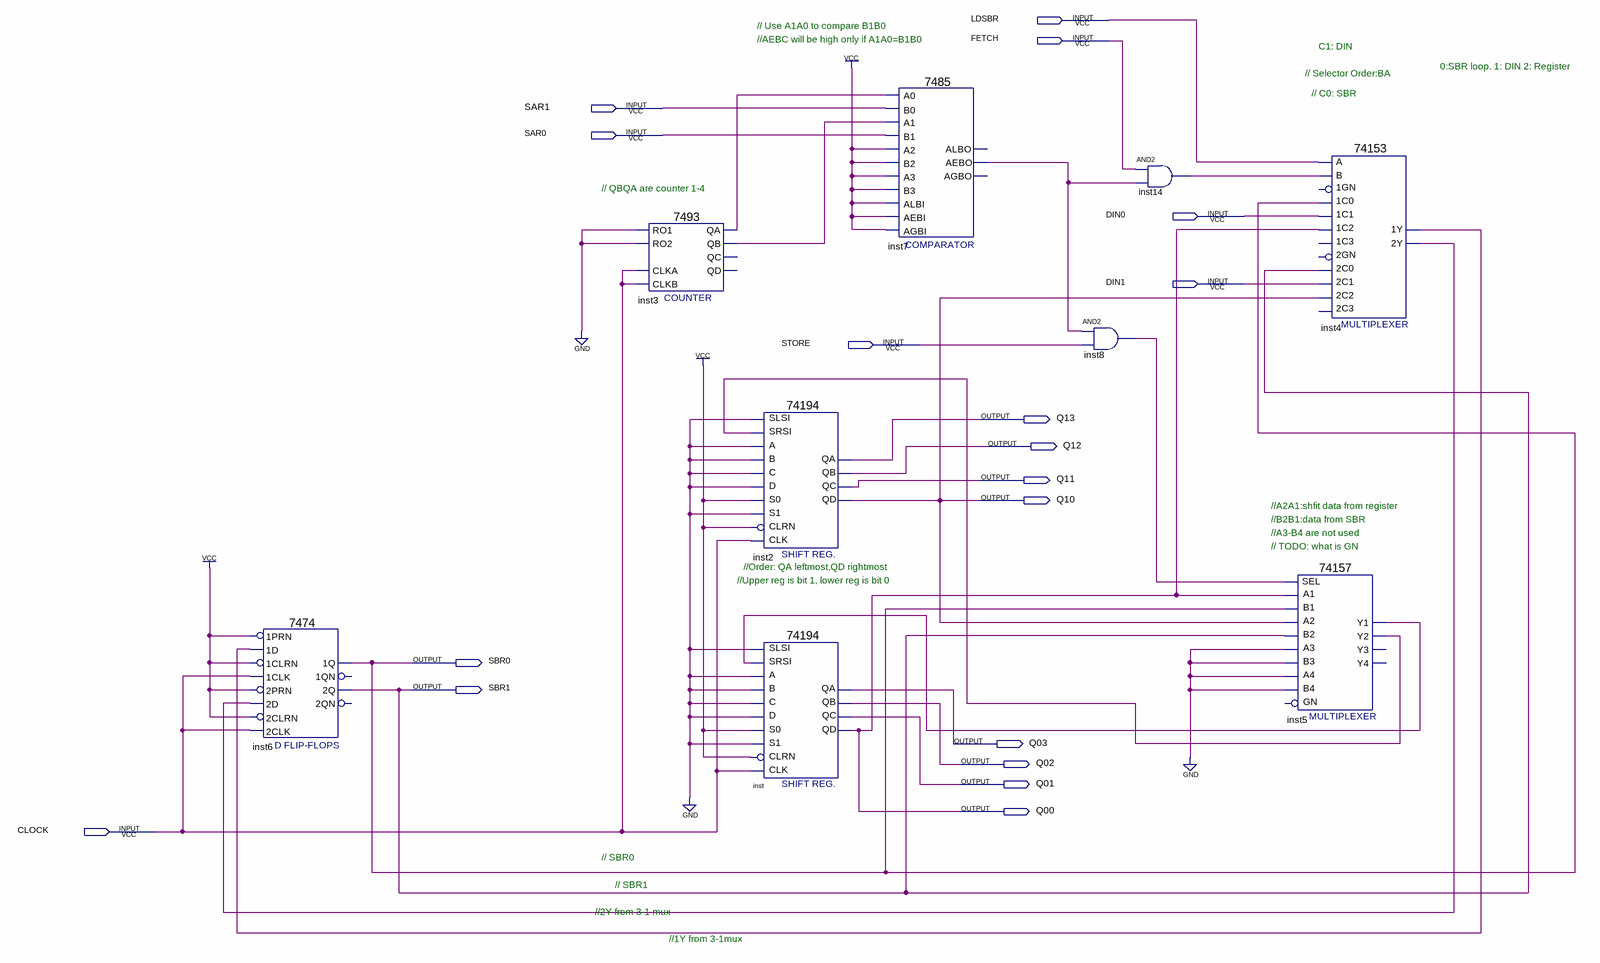
[diagram p0: schematic sheet]
// Quartus schematic Lab2.bdf as structural Verilog: 9 symbols, 18 pins
module Lab2 (
  input  LDSBR,
  input  FETCH,
  input  SAR1,
  input  SAR0,
  input  DIN0,
  input  DIN1,
  input  STORE,
  input  CLOCK,
  output Q13,
  output Q12,
  output Q11,
  output Q10,
  output SBR0,
  output SBR1,
  output Q03,
  output Q02,
  output Q01,
  output Q00
);

  wire inst3_qa, inst3_qb, inst4_1y, inst4_2y, inst5_y1, inst5_y2, inst7_aebo, inst8_out, inst14_out;

  \7474  inst6 (
    .\2D (inst4_2y), .\2PRN (1'b1), .\1CLK (CLOCK), .\1D (inst4_1y), .\1PRN (1'b1), .\2CLK (CLOCK),
    .\2CLRN (1'b1), .\1CLRN (1'b1), .\2Q (SBR1), .\1Q (SBR0));  // open: 1QN, 2QN
  \7493  inst3 (.RO1(1'b0), .RO2(1'b0), .CLKA(CLOCK), .CLKB(CLOCK), .QB(inst3_qb), .QA(inst3_qa));  // open: QC, QD
  \74194  inst2 (
    .SLSI(1'b0), .SRSI(inst5_y2), .B(1'b0), .C(1'b0), .CLK(CLOCK), .CLRN(1'b1), .D(1'b0), .S1(1'b0),
    .S0(1'b1), .A(1'b0), .QA(Q13), .QB(Q12), .QC(Q11), .QD(Q10));
  \74194  inst (
    .SLSI(1'b0), .SRSI(inst5_y1), .B(1'b0), .C(1'b0), .CLK(CLOCK), .CLRN(1'b1), .D(1'b0), .S1(1'b0),
    .S0(1'b1), .A(1'b0), .QA(Q03), .QB(Q02), .QC(Q01), .QD(Q00));
  \7485  inst7 (
    .A3(1'b1), .B2(1'b1), .A2(1'b1), .AEBI(1'b1), .AGBI(1'b1), .ALBI(1'b1), .A0(inst3_qa), .B0(SAR1),
    .B3(1'b1), .A1(inst3_qb), .B1(SAR0), .AEBO(inst7_aebo));  // open: ALBO, AGBO
  and inst8 (inst8_out, inst7_aebo, STORE);
  and inst14 (inst14_out, FETCH, inst7_aebo);
  \74157  inst5 (
    .A1(Q00), .B1(SBR0), .SEL(inst8_out), .B2(SBR1), .A3(1'b0), .B3(1'b0), .A2(Q10), .B4(1'b0), .A4(1'b0),
    .Y2(inst5_y2), .Y1(inst5_y1));  // open: GN, Y4, Y3
  \74153  inst4 (
    .\1C1 (DIN0), .\1C0 (SBR0), .\2C0 (SBR1), .\2C2 (Q10), .\1C2 (Q00), .B(inst14_out), .A(LDSBR),
    .\2C1 (DIN1), .\1Y (inst4_1y), .\2Y (inst4_2y));  // open: 1GN, 2GN, 1C3, 2C3

  // Notes on the sheet:
  //   // Use A1A0 to compare B1B0
  //   //AEBC will be high only if A1A0=B1B0
  //   C1: DIN
  //   0:SBR loop. 1: DIN 2: Register
  //   // Selector Order:BA
  //   // C0: SBR
  //   // QBQA are counter 1-4
  //   //A2A1:shfit data from register
  //   //B2B1:data from SBR
  //   //A3-B4 are not used
  //   // TODO: what is GN
  //   //Order: QA leftmost,QD rightmost
  //   //Upper reg is bit 1, lower reg is bit 0
  //   // SBR0
  //   // SBR1
  //   //2Y from 3-1 mux
  //   //1Y from 3-1mux
endmodule
